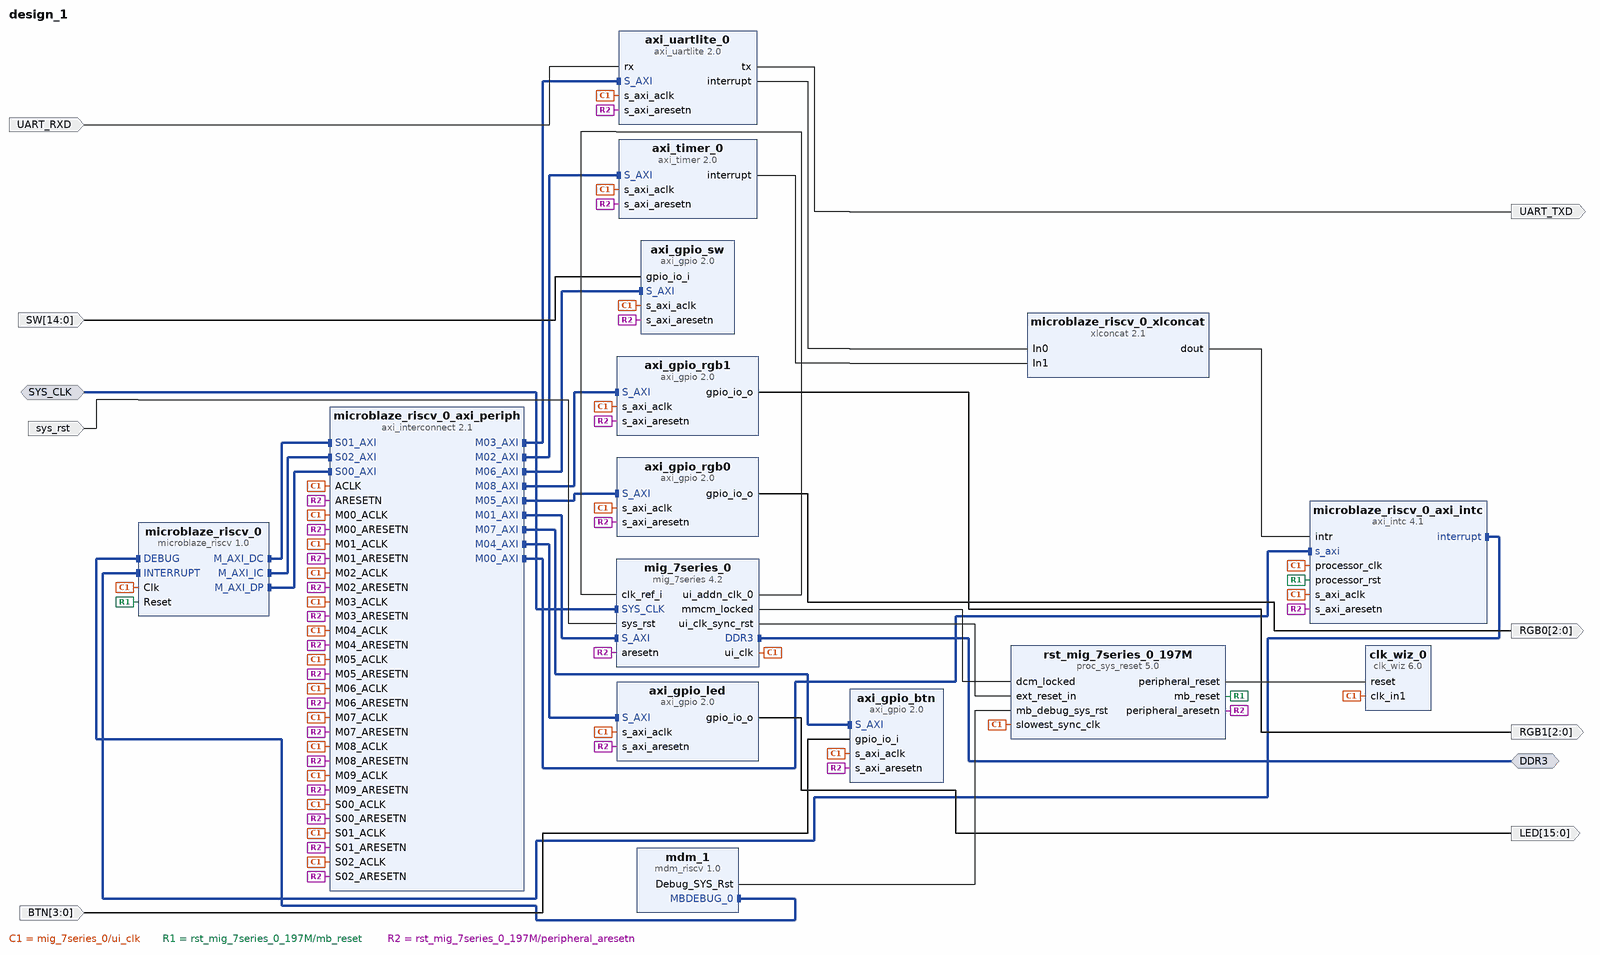
[diagram p0: block diagram of the top level]
# Vivado block design design_1, xc7s50csga324-1, Vivado 2024.1
create_bd_design design_1

create_bd_intf_port -mode Master -vlnv xilinx.com:interface:ddrx_rtl:1.0 DDR3
create_bd_intf_port -mode Slave -vlnv xilinx.com:interface:diff_clock_rtl:1.0 SYS_CLK
create_bd_port -dir I -type rst sys_rst
create_bd_port -dir I UART_RXD
create_bd_port -dir O UART_TXD
create_bd_port -dir O -from 2 -to 0 RGB0
create_bd_port -dir O -from 2 -to 0 RGB1
create_bd_port -dir I -from 3 -to 0 BTN
create_bd_port -dir O -from 15 -to 0 LED
create_bd_port -dir I -from 14 -to 0 SW

create_bd_cell -type ip -vlnv xilinx.com:ip:microblaze_riscv:1.0 microblaze_riscv_0
set_property -dict [list \
  CONFIG.C_DEBUG_ENABLED 1 \
  CONFIG.C_D_AXI 1 \
  CONFIG.C_D_LMB 0 \
  CONFIG.C_I_AXI 0 \
  CONFIG.C_I_LMB 0 \
  CONFIG.C_TRACE 0 \
  CONFIG.C_USE_DCACHE 1 \
  CONFIG.C_USE_ICACHE 1 \
  CONFIG.G_TEMPLATE_LIST 1 \
] [get_bd_cells microblaze_riscv_0]
create_bd_cell -type ip -vlnv xilinx.com:ip:mig_7series:4.2 mig_7series_0
set_property -dict [list \
  CONFIG.BOARD_MIG_PARAM Custom \
  CONFIG.RESET_BOARD_INTERFACE Custom \
  CONFIG.XML_INPUT_FILE mig_a.prj \
] [get_bd_cells mig_7series_0]
create_bd_cell -type ip -vlnv xilinx.com:ip:axi_interconnect:2.1 microblaze_riscv_0_axi_periph
set_property -dict {CONFIG.NUM_MI 10 CONFIG.NUM_SI 3} [get_bd_cells microblaze_riscv_0_axi_periph]
create_bd_cell -type ip -vlnv xilinx.com:ip:axi_intc:4.1 microblaze_riscv_0_axi_intc
set_property -dict {CONFIG.C_HAS_FAST 1} [get_bd_cells microblaze_riscv_0_axi_intc]
create_bd_cell -type ip -vlnv xilinx.com:ip:xlconcat:2.1 microblaze_riscv_0_xlconcat
create_bd_cell -type ip -vlnv xilinx.com:ip:mdm_riscv:1.0 mdm_1
create_bd_cell -type ip -vlnv xilinx.com:ip:proc_sys_reset:5.0 rst_mig_7series_0_197M
create_bd_cell -type ip -vlnv xilinx.com:ip:axi_uartlite:2.0 axi_uartlite_0
set_property -dict {CONFIG.C_BAUDRATE 115200} [get_bd_cells axi_uartlite_0]
create_bd_cell -type ip -vlnv xilinx.com:ip:axi_timer:2.0 axi_timer_0
set_property -dict {CONFIG.enable_timer2 0} [get_bd_cells axi_timer_0]
create_bd_cell -type ip -vlnv xilinx.com:ip:axi_gpio:2.0 axi_gpio_sw
set_property -dict {CONFIG.C_ALL_INPUTS 1 CONFIG.C_GPIO_WIDTH 15 CONFIG.C_IS_DUAL 0} [get_bd_cells axi_gpio_sw]
create_bd_cell -type ip -vlnv xilinx.com:ip:axi_gpio:2.0 axi_gpio_rgb0
set_property -dict {CONFIG.C_ALL_OUTPUTS 1 CONFIG.C_GPIO_WIDTH 3 CONFIG.C_IS_DUAL 0} [get_bd_cells axi_gpio_rgb0]
create_bd_cell -type ip -vlnv xilinx.com:ip:axi_gpio:2.0 axi_gpio_led
set_property -dict {CONFIG.C_ALL_OUTPUTS 1 CONFIG.C_GPIO_WIDTH 16} [get_bd_cells axi_gpio_led]
create_bd_cell -type ip -vlnv xilinx.com:ip:axi_gpio:2.0 axi_gpio_btn
set_property -dict {CONFIG.C_ALL_INPUTS 1 CONFIG.C_GPIO_WIDTH 4} [get_bd_cells axi_gpio_btn]
create_bd_cell -type ip -vlnv xilinx.com:ip:axi_gpio:2.0 axi_gpio_rgb1
set_property -dict {CONFIG.C_ALL_OUTPUTS 1 CONFIG.C_GPIO_WIDTH 3} [get_bd_cells axi_gpio_rgb1]
create_bd_cell -type ip -vlnv xilinx.com:ip:clk_wiz:6.0 clk_wiz_0
set_property -dict [list \
  CONFIG.CLKOUT1_JITTER 252.027 \
  CONFIG.CLKOUT1_REQUESTED_OUT_FREQ 25.000 \
  CONFIG.CLKOUT2_JITTER 202.568 \
  CONFIG.CLKOUT2_PHASE_ERROR 277.428 \
  CONFIG.CLKOUT2_REQUESTED_OUT_FREQ 125.000 \
  CONFIG.CLKOUT2_USED true \
  CONFIG.CLK_OUT1_PORT clk_25MHz \
  CONFIG.CLK_OUT2_PORT clk_125MHz \
  CONFIG.MMCM_CLKOUT0_DIVIDE_F 44.875 \
  CONFIG.MMCM_CLKOUT1_DIVIDE 9 \
  CONFIG.NUM_OUT_CLKS 2 \
] [get_bd_cells clk_wiz_0]

# ---- connections ----

connect_bd_intf_net -intf_net SYS_CLK_0_1 [get_bd_intf_ports SYS_CLK] [get_bd_intf_pins mig_7series_0/SYS_CLK]
connect_bd_intf_net [get_bd_intf_pins microblaze_riscv_0/M_AXI_DC] [get_bd_intf_pins microblaze_riscv_0_axi_periph/S01_AXI]
connect_bd_intf_net [get_bd_intf_pins microblaze_riscv_0/M_AXI_IC] [get_bd_intf_pins microblaze_riscv_0_axi_periph/S02_AXI]
connect_bd_intf_net -intf_net microblaze_riscv_0_axi_dp [get_bd_intf_pins microblaze_riscv_0_axi_periph/S00_AXI] [get_bd_intf_pins microblaze_riscv_0/M_AXI_DP]
connect_bd_intf_net [get_bd_intf_pins microblaze_riscv_0_axi_periph/M01_AXI] [get_bd_intf_pins mig_7series_0/S_AXI]
connect_bd_intf_net [get_bd_intf_pins microblaze_riscv_0_axi_periph/M02_AXI] [get_bd_intf_pins axi_timer_0/S_AXI]
connect_bd_intf_net [get_bd_intf_pins microblaze_riscv_0_axi_periph/M03_AXI] [get_bd_intf_pins axi_uartlite_0/S_AXI]
connect_bd_intf_net [get_bd_intf_pins microblaze_riscv_0_axi_periph/M04_AXI] [get_bd_intf_pins axi_gpio_led/S_AXI]
connect_bd_intf_net [get_bd_intf_pins microblaze_riscv_0_axi_periph/M05_AXI] [get_bd_intf_pins axi_gpio_rgb0/S_AXI]
connect_bd_intf_net [get_bd_intf_pins microblaze_riscv_0_axi_periph/M06_AXI] [get_bd_intf_pins axi_gpio_sw/S_AXI]
connect_bd_intf_net [get_bd_intf_pins microblaze_riscv_0_axi_periph/M07_AXI] [get_bd_intf_pins axi_gpio_btn/S_AXI]
connect_bd_intf_net [get_bd_intf_pins microblaze_riscv_0_axi_periph/M08_AXI] [get_bd_intf_pins axi_gpio_rgb1/S_AXI]
connect_bd_intf_net [get_bd_intf_pins mdm_1/MBDEBUG_0] [get_bd_intf_pins microblaze_riscv_0/DEBUG]
connect_bd_intf_net -intf_net microblaze_riscv_0_intc_axi [get_bd_intf_pins microblaze_riscv_0_axi_periph/M00_AXI] [get_bd_intf_pins microblaze_riscv_0_axi_intc/s_axi]
connect_bd_intf_net [get_bd_intf_pins microblaze_riscv_0_axi_intc/interrupt] [get_bd_intf_pins microblaze_riscv_0/INTERRUPT]
connect_bd_intf_net [get_bd_intf_ports DDR3] [get_bd_intf_pins mig_7series_0/DDR3]
connect_bd_net [get_bd_pins axi_gpio_led/gpio_io_o] [get_bd_ports LED]
connect_bd_net -net axi_gpio_rgb0_rgb1_gpio_io_o [get_bd_pins axi_gpio_rgb0/gpio_io_o] [get_bd_ports RGB0]
connect_bd_net [get_bd_pins axi_gpio_rgb1/gpio_io_o] [get_bd_ports RGB1]
connect_bd_net [get_bd_pins axi_timer_0/interrupt] [get_bd_pins microblaze_riscv_0_xlconcat/In1]
connect_bd_net [get_bd_pins axi_uartlite_0/interrupt] [get_bd_pins microblaze_riscv_0_xlconcat/In0]
connect_bd_net [get_bd_pins axi_uartlite_0/tx] [get_bd_ports UART_TXD]
connect_bd_net -net gpio_io_i_0_1 [get_bd_ports SW] [get_bd_pins axi_gpio_sw/gpio_io_i]
connect_bd_net -net gpio_io_i_0_2 [get_bd_ports BTN] [get_bd_pins axi_gpio_btn/gpio_io_i]
connect_bd_net [get_bd_pins mdm_1/Debug_SYS_Rst] [get_bd_pins rst_mig_7series_0_197M/mb_debug_sys_rst]
connect_bd_net -net microblaze_riscv_0_intr [get_bd_pins microblaze_riscv_0_xlconcat/dout] [get_bd_pins microblaze_riscv_0_axi_intc/intr]
connect_bd_net [get_bd_pins mig_7series_0/mmcm_locked] [get_bd_pins rst_mig_7series_0_197M/dcm_locked]
connect_bd_net [get_bd_pins mig_7series_0/ui_addn_clk_0] [get_bd_pins mig_7series_0/clk_ref_i]
connect_bd_net [get_bd_pins mig_7series_0/ui_clk] \
  [get_bd_pins microblaze_riscv_0/Clk] [get_bd_pins microblaze_riscv_0_axi_periph/ACLK] \
  [get_bd_pins microblaze_riscv_0_axi_periph/M00_ACLK] [get_bd_pins microblaze_riscv_0_axi_periph/M01_ACLK] \
  [get_bd_pins microblaze_riscv_0_axi_periph/S00_ACLK] [get_bd_pins microblaze_riscv_0_axi_periph/S01_ACLK] \
  [get_bd_pins microblaze_riscv_0_axi_periph/S02_ACLK] [get_bd_pins rst_mig_7series_0_197M/slowest_sync_clk] \
  [get_bd_pins microblaze_riscv_0_axi_intc/processor_clk] [get_bd_pins microblaze_riscv_0_axi_intc/s_axi_aclk] \
  [get_bd_pins axi_timer_0/s_axi_aclk] [get_bd_pins microblaze_riscv_0_axi_periph/M02_ACLK] \
  [get_bd_pins axi_uartlite_0/s_axi_aclk] [get_bd_pins microblaze_riscv_0_axi_periph/M03_ACLK] \
  [get_bd_pins axi_gpio_led/s_axi_aclk] [get_bd_pins microblaze_riscv_0_axi_periph/M04_ACLK] \
  [get_bd_pins axi_gpio_rgb0/s_axi_aclk] [get_bd_pins microblaze_riscv_0_axi_periph/M05_ACLK] \
  [get_bd_pins axi_gpio_sw/s_axi_aclk] [get_bd_pins microblaze_riscv_0_axi_periph/M06_ACLK] \
  [get_bd_pins axi_gpio_btn/s_axi_aclk] [get_bd_pins microblaze_riscv_0_axi_periph/M07_ACLK] \
  [get_bd_pins axi_gpio_rgb1/s_axi_aclk] [get_bd_pins microblaze_riscv_0_axi_periph/M08_ACLK] [get_bd_pins clk_wiz_0/clk_in1] \
  [get_bd_pins microblaze_riscv_0_axi_periph/M09_ACLK]
connect_bd_net [get_bd_pins mig_7series_0/ui_clk_sync_rst] [get_bd_pins rst_mig_7series_0_197M/ext_reset_in]
connect_bd_net [get_bd_pins rst_mig_7series_0_197M/mb_reset] \
  [get_bd_pins microblaze_riscv_0/Reset] [get_bd_pins microblaze_riscv_0_axi_intc/processor_rst]
connect_bd_net [get_bd_pins rst_mig_7series_0_197M/peripheral_aresetn] \
  [get_bd_pins microblaze_riscv_0_axi_periph/ARESETN] [get_bd_pins microblaze_riscv_0_axi_periph/S00_ARESETN] \
  [get_bd_pins microblaze_riscv_0_axi_periph/M00_ARESETN] [get_bd_pins microblaze_riscv_0_axi_intc/s_axi_aresetn] \
  [get_bd_pins microblaze_riscv_0_axi_periph/M01_ARESETN] [get_bd_pins microblaze_riscv_0_axi_periph/S01_ARESETN] \
  [get_bd_pins microblaze_riscv_0_axi_periph/S02_ARESETN] [get_bd_pins mig_7series_0/aresetn] \
  [get_bd_pins axi_timer_0/s_axi_aresetn] [get_bd_pins microblaze_riscv_0_axi_periph/M02_ARESETN] \
  [get_bd_pins axi_uartlite_0/s_axi_aresetn] [get_bd_pins microblaze_riscv_0_axi_periph/M03_ARESETN] \
  [get_bd_pins axi_gpio_led/s_axi_aresetn] [get_bd_pins microblaze_riscv_0_axi_periph/M04_ARESETN] \
  [get_bd_pins axi_gpio_rgb0/s_axi_aresetn] [get_bd_pins microblaze_riscv_0_axi_periph/M05_ARESETN] \
  [get_bd_pins axi_gpio_sw/s_axi_aresetn] [get_bd_pins microblaze_riscv_0_axi_periph/M06_ARESETN] \
  [get_bd_pins axi_gpio_btn/s_axi_aresetn] [get_bd_pins microblaze_riscv_0_axi_periph/M07_ARESETN] \
  [get_bd_pins axi_gpio_rgb1/s_axi_aresetn] [get_bd_pins microblaze_riscv_0_axi_periph/M08_ARESETN] \
  [get_bd_pins microblaze_riscv_0_axi_periph/M09_ARESETN]
connect_bd_net [get_bd_pins rst_mig_7series_0_197M/peripheral_reset] [get_bd_pins clk_wiz_0/reset]
connect_bd_net -net rx_0_1 [get_bd_ports UART_RXD] [get_bd_pins axi_uartlite_0/rx]
connect_bd_net -net sys_rst_0_1 [get_bd_ports sys_rst] [get_bd_pins mig_7series_0/sys_rst]

# ---- address map ----
assign_bd_address -offset 0x40000000 -range 64K -target_address_space [get_bd_addr_spaces microblaze_riscv_0/Data] [get_bd_addr_segs axi_gpio_led/S_AXI/Reg]
assign_bd_address -offset 0x40010000 -range 64K -target_address_space [get_bd_addr_spaces microblaze_riscv_0/Data] [get_bd_addr_segs axi_gpio_rgb0/S_AXI/Reg]
assign_bd_address -offset 0x40020000 -range 64K -target_address_space [get_bd_addr_spaces microblaze_riscv_0/Data] [get_bd_addr_segs axi_gpio_sw/S_AXI/Reg]
assign_bd_address -offset 0x40030000 -range 64K -target_address_space [get_bd_addr_spaces microblaze_riscv_0/Data] [get_bd_addr_segs axi_gpio_btn/S_AXI/Reg]
assign_bd_address -offset 0x40040000 -range 64K -target_address_space [get_bd_addr_spaces microblaze_riscv_0/Data] [get_bd_addr_segs axi_gpio_rgb1/S_AXI/Reg]
assign_bd_address -offset 0x40600000 -range 64K -target_address_space [get_bd_addr_spaces microblaze_riscv_0/Data] [get_bd_addr_segs axi_uartlite_0/S_AXI/Reg]
assign_bd_address -offset 0x41200000 -range 64K -target_address_space [get_bd_addr_spaces microblaze_riscv_0/Data] [get_bd_addr_segs microblaze_riscv_0_axi_intc/S_AXI/Reg]
assign_bd_address -offset 0x41C00000 -range 64K -target_address_space [get_bd_addr_spaces microblaze_riscv_0/Data] [get_bd_addr_segs axi_timer_0/S_AXI/Reg]
assign_bd_address -offset 0x80000000 -range 128M -target_address_space [get_bd_addr_spaces microblaze_riscv_0/Data] [get_bd_addr_segs mig_7series_0/memmap/memaddr]
assign_bd_address -offset 0x40000000 -range 64K -target_address_space [get_bd_addr_spaces microblaze_riscv_0/Instruction] [get_bd_addr_segs axi_gpio_led/S_AXI/Reg]
assign_bd_address -offset 0x40010000 -range 64K -target_address_space [get_bd_addr_spaces microblaze_riscv_0/Instruction] [get_bd_addr_segs axi_gpio_rgb0/S_AXI/Reg]
assign_bd_address -offset 0x40020000 -range 64K -target_address_space [get_bd_addr_spaces microblaze_riscv_0/Instruction] [get_bd_addr_segs axi_gpio_sw/S_AXI/Reg]
assign_bd_address -offset 0x40030000 -range 64K -target_address_space [get_bd_addr_spaces microblaze_riscv_0/Instruction] [get_bd_addr_segs axi_gpio_btn/S_AXI/Reg]
assign_bd_address -offset 0x40040000 -range 64K -target_address_space [get_bd_addr_spaces microblaze_riscv_0/Instruction] [get_bd_addr_segs axi_gpio_rgb1/S_AXI/Reg]
assign_bd_address -offset 0x40600000 -range 64K -target_address_space [get_bd_addr_spaces microblaze_riscv_0/Instruction] [get_bd_addr_segs axi_uartlite_0/S_AXI/Reg]
assign_bd_address -offset 0x41200000 -range 64K -target_address_space [get_bd_addr_spaces microblaze_riscv_0/Instruction] [get_bd_addr_segs microblaze_riscv_0_axi_intc/S_AXI/Reg]
assign_bd_address -offset 0x41C00000 -range 64K -target_address_space [get_bd_addr_spaces microblaze_riscv_0/Instruction] [get_bd_addr_segs axi_timer_0/S_AXI/Reg]
assign_bd_address -offset 0x80000000 -range 128M -target_address_space [get_bd_addr_spaces microblaze_riscv_0/Instruction] [get_bd_addr_segs mig_7series_0/memmap/memaddr]

validate_bd_design
save_bd_design
